# EAGLE design untitled (EAGLE 7.2.0)
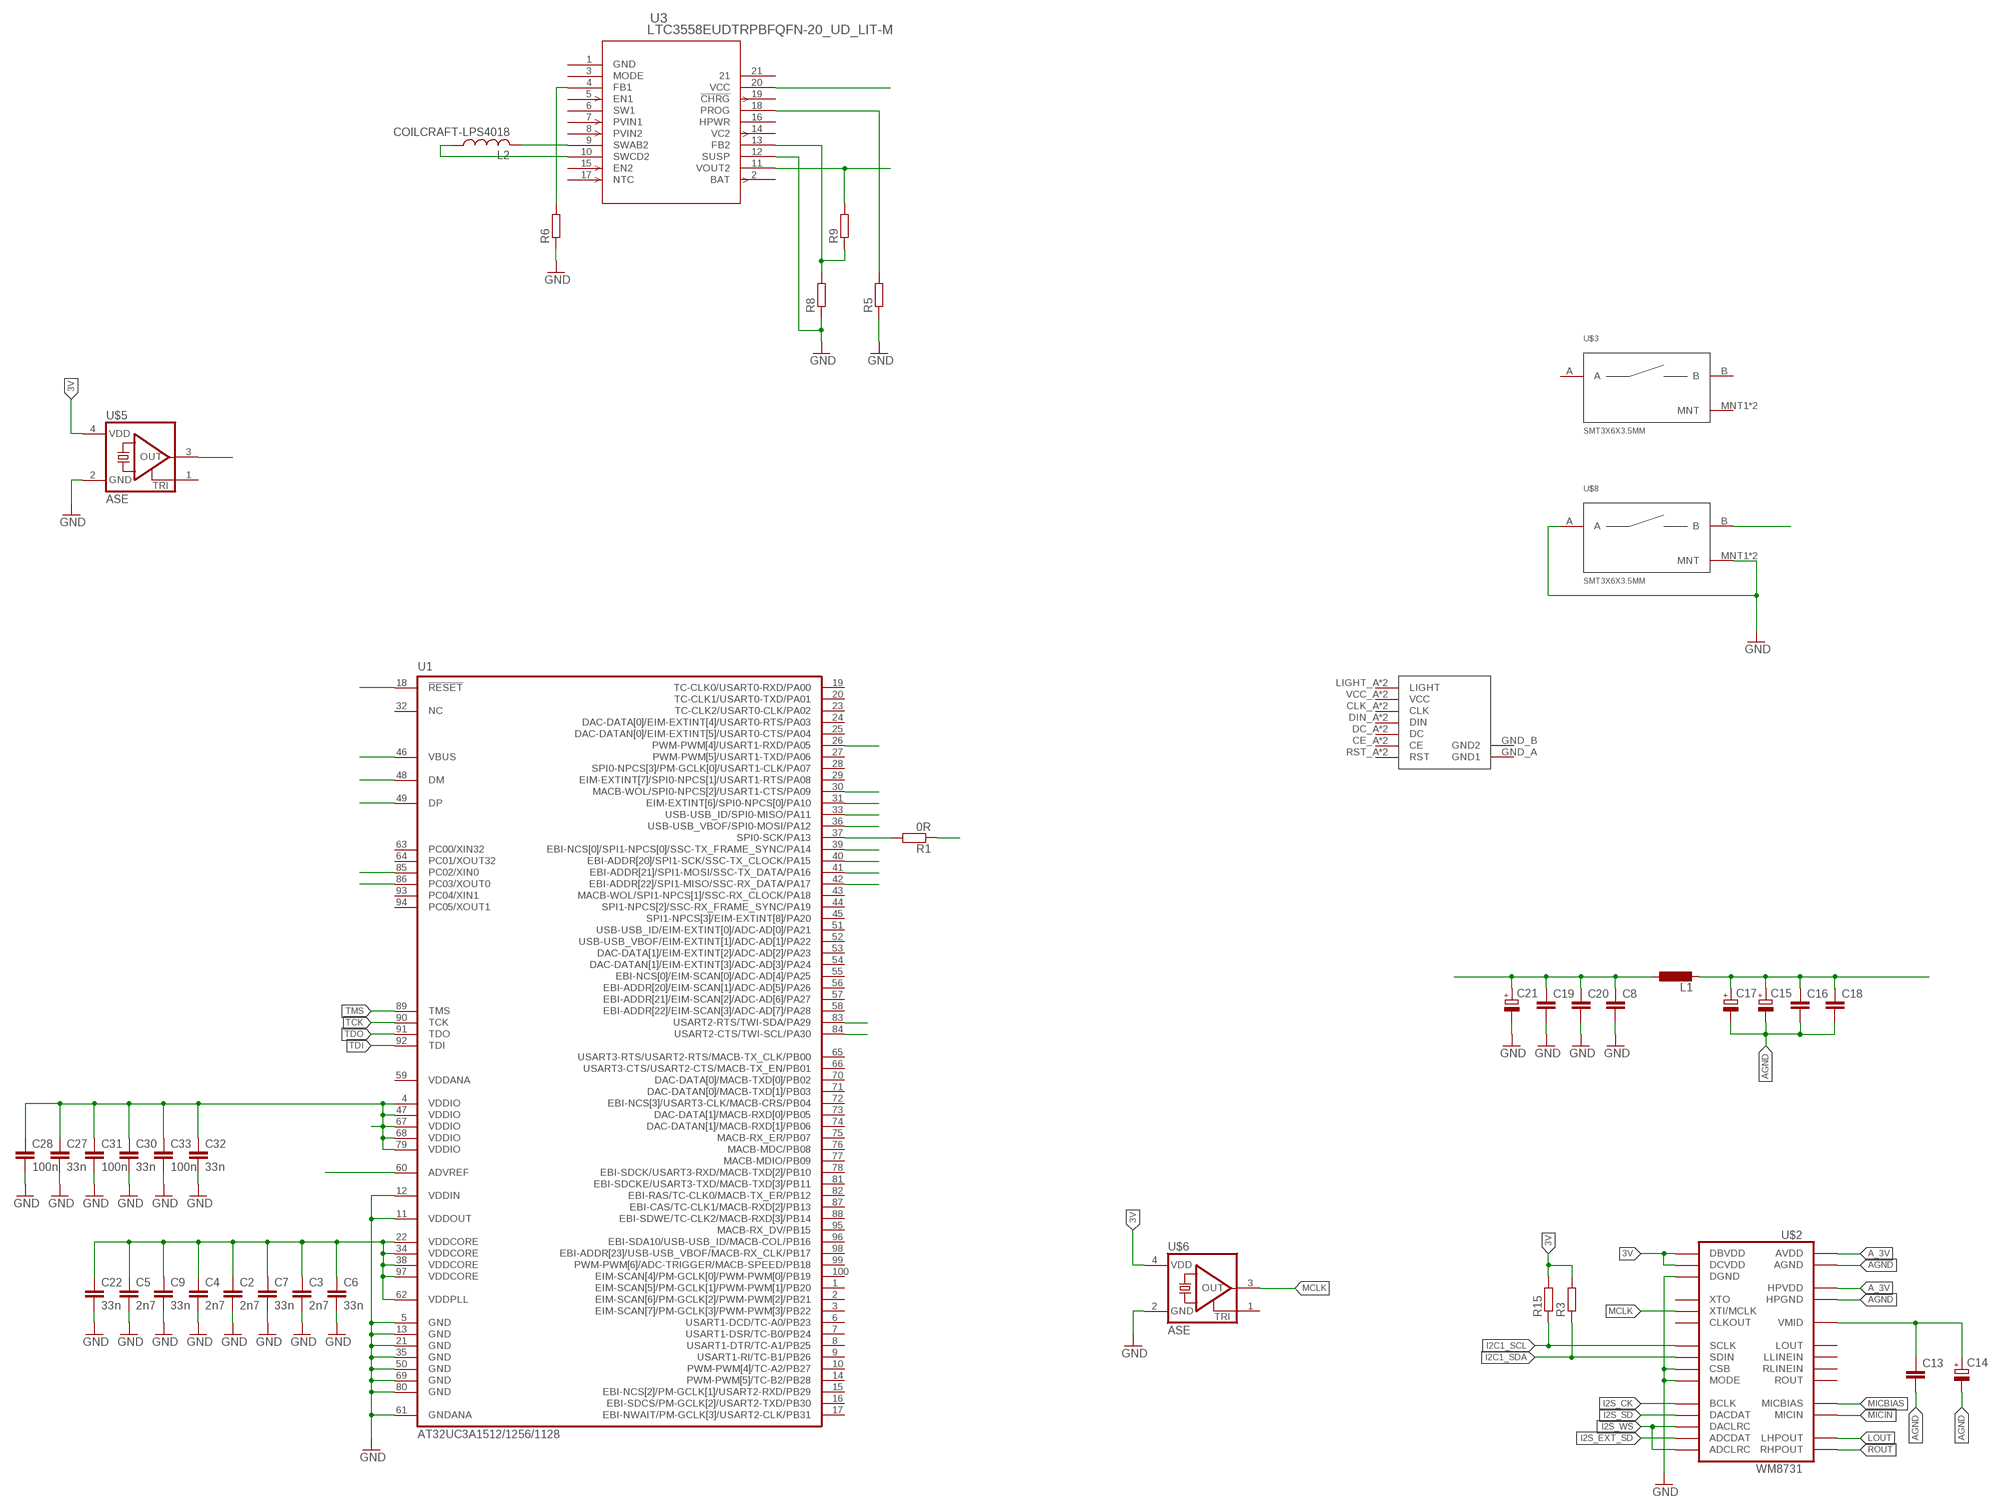
[diagram p0: schematic, sheet 1, part 1 of 2]
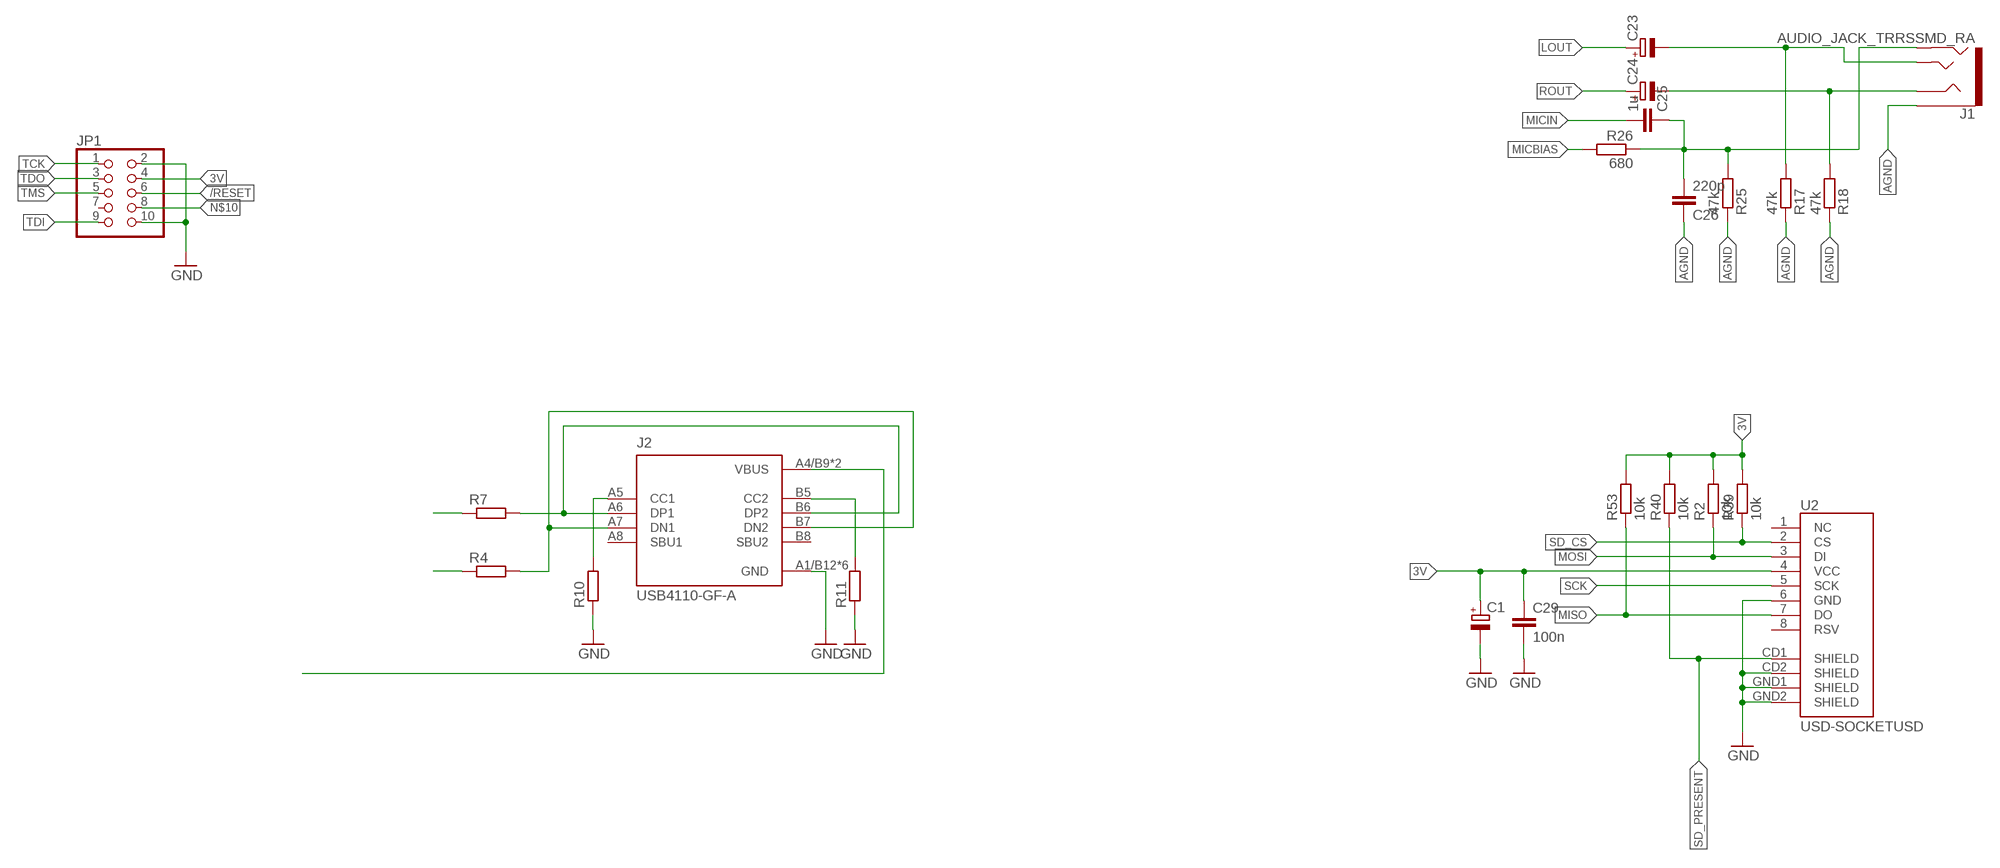
[diagram p1: schematic, sheet 1, part 2 of 2]

## Parts
C1  CPOL-EUSMCA  [SMC_A]
C2  2n7  C-EUC0402  [C0402]
C3  2n7  C-EUC0402  [C0402]
C4  2n7  C-EUC0402  [C0402]
C5  2n7  C-EUC0402  [C0402]
C6  33n  C-EUC0402  [C0402]
C7  33n  C-EUC0402  [C0402]
C8  C-EUC0402  [C0402]
C9  33n  C-EUC0402  [C0402]
C13  C-EUC0603  [C0603]
C14  CPOL-EUSMCA  [SMC_A]
C15  CPOL-EUSMCA  [SMC_A]
C16  C-EUC0603  [C0603]
C17  CPOL-EUSMCA  [SMC_A]
C18  C-EUC0603  [C0603]
C19  C-EUC0603  [C0603]
C20  C-EUC0402  [C0402]
C21  CPOL-EUSMCA  [SMC_A]
C22  33n  C-EUC0402  [C0402]
C23  CPOL-EUSMCE  [SMC_E]
C24  CPOL-EUSMCE  [SMC_E]
C25  1u  C-EUC0603  [C0603]
C26  220p  C-EUC0603  [C0603]
C27  33n  C-EUC0402  [C0402]
C28  100n  C-EUC0402  [C0402]
C29  100n  C-EUC0603  [C0603]
C30  33n  C-EUC0402  [C0402]
C31  100n  C-EUC0402  [C0402]
C32  33n  C-EUC0402  [C0402]
C33  100n  C-EUC0402  [C0402]
J1  AUDIO_JACK_TRRSSMD_RA  [AUDIO_JACK_3.5MM_TRRS_SMD_RA]
J2  USB4110-GF-A  [GCT_USB4110-GF-A]
JP1  PINHD-2X5  [2X05]
L1  L-EUL3225M  [L3225M]
L2  COILCRAFT-LPS4018  [LPS4018]
R1  0R  R-EU_R0603  [R0603]
R2  10k  R-EU_R0402  [R0402]
R3  R-EU_R0402  [R0402]
R4  R-EU_R0402  [R0402]
R5  R-EU_R0402  [R0402]
R6  R-EU_R0402  [R0402]
R7  R-EU_R0402  [R0402]
R8  R-EU_R0402  [R0402]
R9  R-EU_R0402  [R0402]
R10  R-EU_R0402  [R0402]
R11  R-EU_R0402  [R0402]
R15  R-EU_R0402  [R0402]
R17  47k  R-EU_R0603  [R0603]
R18  47k  R-EU_R0603  [R0603]
R25  47k  R-EU_R0603  [R0603]
R26  680  R-EU_R0603  [R0603]
R39  10k  R-EU_R0603  [R0603]
R40  10k  R-EU_R0603  [R0603]
R53  10k  R-EU_R0603  [R0603]
U1  AT32UC3A1512/1256/1128  [TQFP100]
U2  USD-SOCKETUSD  [USD-SOCKET-PP]
U3  LTC3558EUDTRPBFQFN-20_UD_LIT-M  [QFN-20_UD_LIT-M]
U$1  NOKIA5110_LCD  [NOKIA5110_LCD]
U$2  WM8731  [28-SSOP]
U$3  SMT3X6X3.5MM  [SMT3X6X3.5MM]
U$5  ASE  [ASE]
U$6  ASE  [ASE]
U$8  SMT3X6X3.5MM  [SMT3X6X3.5MM]

## Nets
3V: C1.+ C8.1 C19.1 C20.1 C21.+ C27.1 C28.1 C29.1 C30.1 C31.1 C32.1 C33.1 JP1.4 L1.1 R2.2 R3.2 R9.2 R15.2 R39.2 R40.2 R53.2 U1.4(VDDIO) U1.47(VDDIO) U1.60(ADVREF) U1.67(VDDIO) U1.68(VDDIO) U1.79(VDDIO) U2.4(VCC) U3.11(VOUT2) U$2.P$1(DBVDD) U$2.P$27(DCVDD) U$5.4(VDD) U$6.4(VDD)
/RESET: JP1.6 U1.18(!RESET)
A_3V: C15.+ C16.1 C17.+ C18.1 L1.2 U$2.P$8(HPVDD) U$2.P$14(AVDD)
AGND: C13.2 C14.- C15.- C16.2 C17.- C18.2 C26.1 J1.EARTH R17.1 R18.1 R25.1 U$2.P$11(HPGND) U$2.P$15(AGND)
D2_N: J2.A7(DN1) J2.B7(DN2) R4.2
D2_P: J2.A6(DP1) J2.B6(DP2) R7.2
D_N: R4.1 U1.48(DM)
D_P: R7.1 U1.49(DP)
GND: C1.- C2.2 C3.2 C4.2 C5.2 C6.2 C7.2 C8.2 C9.2 C19.2 C20.2 C21.- C22.2 C27.2 C28.2 C29.2 C30.2 C31.2 C32.2 C33.2 J2.A1/B12(GND) J2.B1/A12(GND) J2.S1(GND) J2.S2(GND) J2.S3(GND) J2.S4(GND) JP1.2 JP1.10 R5.1 R6.1 R8.1 R10.1 R11.1 U1.5(GND) U1.11(VDDOUT) U1.12(VDDIN) U1.13(GND) U1.21(GND) U1.35(GND) U1.50(GND) U1.61(GNDANA) U1.69(GND) U1.80(GND) U2.6(GND) U2.CD2(SHIELD) U2.GND1(SHIELD) U2.GND2(SHIELD) U3.12(SUSP) U$2.P$21(MODE) U$2.P$22(CSB) U$2.P$28(DGND) U$5.2(GND) U$6.2(GND) U$8.A U$8.MNT1(MNT) U$8.MNT2(MNT)
I2C1_SCL: R15.1 U1.84(USART2-CTS/TWI-SCL/PA30) U$2.P$24(SCLK)
I2C1_SDA: R3.1 U1.83(USART2-RTS/TWI-SDA/PA29) U$2.P$23(SDIN)
I2S_CK: U1.40(EBI-ADDR[20]/SPI1-SCK/SSC-TX_CLOCK/PA15) U$2.P$3(BCLK)
I2S_EXT_SD: U1.42(EBI-ADDR[22]/SPI1-MISO/SSC-RX_DATA/PA17) U$2.P$6(ADCDAT)
I2S_SD: U1.41(EBI-ADDR[21]/SPI1-MOSI/SSC-TX_DATA/PA16) U$2.P$4(DACDAT)
I2S_WS: U1.39(EBI-NCS[0]/SPI1-NPCS[0]/SSC-TX_FRAME_SYNC/PA14) U$2.P$5(DACLRC) U$2.P$7(ADCLRC)
KEY_VOLUP: U1.26(PWM-PWM[4]/USART1-RXD/PA05) U$8.B
LOUT: C23.+ U$2.P$9(LHPOUT)
MCLK: U$2.P$25(XTI/MCLK) U$6.3(OUT)
MICBIAS: R26.2 U$2.P$17(MICBIAS)
MICIN: C25.2 U$2.P$18(MICIN)
MISO: R53.1 U1.33(USB-USB_ID/SPI0-MISO/PA11) U2.7(DO)
MOSI: R2.1 U1.36(USB-USB_VBOF/SPI0-MOSI/PA12) U2.3(DI)
N$1: R1.2 U1.37(SPI0-SCK/PA13)
N$2: L2.2 U3.9(SWAB2)
N$3: L2.1 U3.10(SWCD2)
N$5: R5.2 U3.18(PROG)
N$6: R6.2 U3.4(FB1)
N$7: R8.2 R9.1 U3.13(FB2)
N$8: J2.B5(CC2) R11.2
N$9: J2.A5(CC1) R10.2
N$10: JP1.8
N$12: C13.1 C14.+ U$2.P$16(VMID)
N$13: C23.- J1.TIP R17.2
N$15: C24.- J1.RING1 R18.2
N$55: C25.1 C26.2 J1.RING2 R25.2 R26.1
OSC_IN: U1.85(PC02/XIN0) U$5.3(OUT)
OSC_OUT: U1.86(PC03/XOUT0)
ROUT: C24.+ U$2.P$10(RHPOUT)
SCK: R1.1 U2.5(SCK)
SD_CS: R39.1 U1.31(EIM-EXTINT[6]/SPI0-NPCS[0]/PA10) U2.2(CS)
SD_PRESENT: R40.1 U1.30(MACB-WOL/SPI0-NPCS[2]/USART1-CTS/PA09) U2.CD1(SHIELD)
TCK: JP1.1 U1.90(TCK)
TDI: JP1.9 U1.92(TDI)
TDO: JP1.3 U1.91(TDO)
TMS: JP1.5 U1.89(TMS)
VBUS: J2.A4/B9(VBUS) J2.B4/A9(VBUS) U1.46(VBUS) U3.20(VCC)
VDDCORE: C2.1 C3.1 C4.1 C5.1 C6.1 C7.1 C9.1 C22.1 U1.22(VDDCORE) U1.34(VDDCORE) U1.38(VDDCORE) U1.62(VDDPLL) U1.97(VDDCORE)
Unconnected: J2.A8(SBU1) J2.B8(SBU2) JP1.7 U1.1(EIM-SCAN[5]/PM-GCLK[1]/PWM-PWM[1]/PB20) U1.2(EIM-SCAN[6]/PM-GCLK[2]/PWM-PWM[2]/PB21) U1.3(EIM-SCAN[7]/PM-GCLK[3]/PWM-PWM[3]/PB22) U1.6(USART1-DCD/TC-A0/PB23) U1.7(USART1-DSR/TC-B0/PB24) U1.8(USART1-DTR/TC-A1/PB25) U1.9(USART1-RI/TC-B1/PB26) U1.10(PWM-PWM[4]/TC-A2/PB27) U1.14(PWM-PWM[5]/TC-B2/PB28) U1.15(EBI-NCS[2]/PM-GCLK[1]/USART2-RXD/PB29) U1.16(EBI-SDCS/PM-GCLK[2]/USART2-TXD/PB30) U1.17(EBI-NWAIT/PM-GCLK[3]/USART2-CLK/PB31) U1.19(TC-CLK0/USART0-RXD/PA00) U1.20(TC-CLK1/USART0-TXD/PA01) U1.23(TC-CLK2/USART0-CLK/PA02) U1.24(DAC-DATA[0]/EIM-EXTINT[4]/USART0-RTS/PA03) U1.25(DAC-DATAN[0]/EIM-EXTINT[5]/USART0-CTS/PA04) U1.27(PWM-PWM[5]/USART1-TXD/PA06) U1.28(SPI0-NPCS[3]/PM-GCLK[0]/USART1-CLK/PA07) U1.29(EIM-EXTINT[7]/SPI0-NPCS[1]/USART1-RTS/PA08) U1.32(NC) U1.43(MACB-WOL/SPI1-NPCS[1]/SSC-RX_CLOCK/PA18) U1.44(SPI1-NPCS[2]/SSC-RX_FRAME_SYNC/PA19) U1.45(SPI1-NPCS[3]/EIM-EXTINT[8]/PA20) U1.51(USB-USB_ID/EIM-EXTINT[0]/ADC-AD[0]/PA21) U1.52(USB-USB_VBOF/EIM-EXTINT[1]/ADC-AD[1]/PA22) U1.53(DAC-DATA[1]/EIM-EXTINT[2]/ADC-AD[2]/PA23) U1.54(DAC-DATAN[1]/EIM-EXTINT[3]/ADC-AD[3]/PA24) U1.55(EBI-NCS[0]/EIM-SCAN[0]/ADC-AD[4]/PA25) U1.56(EBI-ADDR[20]/EIM-SCAN[1]/ADC-AD[5]/PA26) U1.57(EBI-ADDR[21]/EIM-SCAN[2]/ADC-AD[6]/PA27) U1.58(EBI-ADDR[22]/EIM-SCAN[3]/ADC-AD[7]/PA28) U1.63(PC00/XIN32) U1.64(PC01/XOUT32) U1.65(USART3-RTS/USART2-RTS/MACB-TX_CLK/PB00) U1.66(USART3-CTS/USART2-CTS/MACB-TX_EN/PB01) U1.70(DAC-DATA[0]/MACB-TXD[0]/PB02) U1.71(DAC-DATAN[0]/MACB-TXD[1]/PB03) U1.72(EBI-NCS[3]/USART3-CLK/MACB-CRS/PB04) U1.73(DAC-DATA[1]/MACB-RXD[0]/PB05) U1.74(DAC-DATAN[1]/MACB-RXD[1]/PB06) U1.75(MACB-RX_ER/PB07) U1.76(MACB-MDC/PB08) U1.77(MACB-MDIO/PB09) U1.78(EBI-SDCK/USART3-RXD/MACB-TXD[2]/PB10) U1.81(EBI-SDCKE/USART3-TXD/MACB-TXD[3]/PB11) U1.82(EBI-RAS/TC-CLK0/MACB-TX_ER/PB12) U1.87(EBI-CAS/TC-CLK1/MACB-RXD[2]/PB13) U1.88(EBI-SDWE/TC-CLK2/MACB-RXD[3]/PB14) U1.93(PC04/XIN1) U1.94(PC05/XOUT1) U1.95(MACB-RX_DV/PB15) U1.96(EBI-SDA10/USB-USB_ID/MACB-COL/PB16) U1.98(EBI-ADDR[23]/USB-USB_VBOF/MACB-RX_CLK/PB17) U1.99(PWM-PWM[6]/ADC-TRIGGER/MACB-SPEED/PB18) U1.100(EIM-SCAN[4]/PM-GCLK[0]/PWM-PWM[0]/PB19) U2.1(NC) U2.8(RSV) U3.2(BAT) U3.3(MODE) U3.5(EN1) U3.6(SW1) U3.7(PVIN1) U3.8(PVIN2) U3.14(VC2) U3.15(EN2) U3.16(HPWR) U3.17(NTC) U3.19(!CHRG) U3.21 U$1.CE_A(CE) U$1.CE_B(CE) U$1.CLK_A(CLK) U$1.CLK_B(CLK) U$1.DC_A(DC) U$1.DC_B(DC) U$1.DIN_A(DIN) U$1.DIN_B(DIN) U$1.GND_A(GND1) U$1.GND_B(GND2) U$1.LIGHT_A(LIGHT) U$1.LIGHT_B(LIGHT) U$1.RST_A(RST) U$1.RST_B(RST) U$1.VCC_A(VCC) U$1.VCC_B(VCC) U$2.P$2(CLKOUT) U$2.P$12(LOUT) U$2.P$13(ROUT) U$2.P$19(RLINEIN) U$2.P$20(LLINEIN) U$2.P$26(XTO) U$3.A U$3.B U$3.MNT1(MNT) U$3.MNT2(MNT) U$5.1(TRI) U$6.1(TRI)

## Power pins joined to a net without a drawn wire
GND: U3.1(GND)
VDDANA: U1.59(VDDANA)

## Library data of the parts
C1 C14 C15 C17 C21 C23 C24 = rcl:CPOL-EU: POLARIZED CAPACITOR, European symbol
C2-C9 C13 C16 C18-C20 C22 C25-C33 = rcl:C-EU: CAPACITOR, European symbol
J1 = SparkFun-Connectors:AUDIO_JACK_TRRS: Audio Jack - 3.5mm TRRS (SMD) This is a 3.5mm TRRS SMD audio jack. TRRS connectors are the audio-style connectors that you see on some phones, MP3 players and development boards. TRRS stands for “tip, ring, ring, sleeve,” which reflects that this has three conductors and a ground. SparkFun Products: Audio Jack <https://www.sparkfun.com/products/12639> mbed Starter Kit <https://www.sparkfun.com/products/12968> SparkFun TRRS 3.5mm Jack Breakout <https://www.sparkfun.com/products/11570>; PROD_ID: CONN-10676; SF_ID: PRT-12639
J2 = connector_tst:USB4110-GF-A: CONN USB 2.0 TYPE-C R/A SMT; DIGIKEY: 073-USB4110-GF-A-1-ND; MANUFACTURER: GCT; MPN: USB4110-GF-A
JP1 = pinhead:PINHD-2X5: PIN HEADER
L1 = rcl:L-EU: INDUCTOR, European symbol
L2 = passives:COILCRAFT-LPS4018: Coilcraft Shielded SMT Power Inductors – LPS4018 Series
R1-R11 R15 R17 R18 R25 R26 R39 R40 R53 = rcl:R-EU_: RESISTOR, European symbol
U1 = atmel-avr32:AT32UC3A1512/1256/1128: AT32UC3A1512/1256/1128
U2 = SparkFun-Connectors:USD-SOCKET: microSD Socket Push-push type uSD socket. Schematic element and footprint production proven. Spark Fun Electronics SKU : PRT-00127. tDoc lines correctly indicate media card edge positions when inserting (unlocked, locked, depressed).
U3 = mw:LTC3558EUDTRPBF; COPYRIGHT: Copyright (C) 2026 Ultra Librarian. All rights reserved.; DATASHEET: https://www.analog.com/media/en/technical-documentation/data-sheets/3558.pdf; DESCRIPTION: Linear USB Battery Charger with Buck and Buck-Boost Regulators; MANUFACTURER_NAME: Analog Devices Inc; MANUFACTURER_PART_NUMBER: LTC3558EUD#TRPBF
U$1 = common:NOKIA5110_LCD
U$2 = microdecv1:WM8731
U$3 U$8 = mw:SMT3X6X3.5MM
U$5 U$6 = crystal:ASE: 3.3Vdc CMOS SMD CRYSTAL CLOCK OSCILLATOR SOurce: www.abracon.com; OC_FARNELL: unknown; OC_NEWARK: unknown

## Board
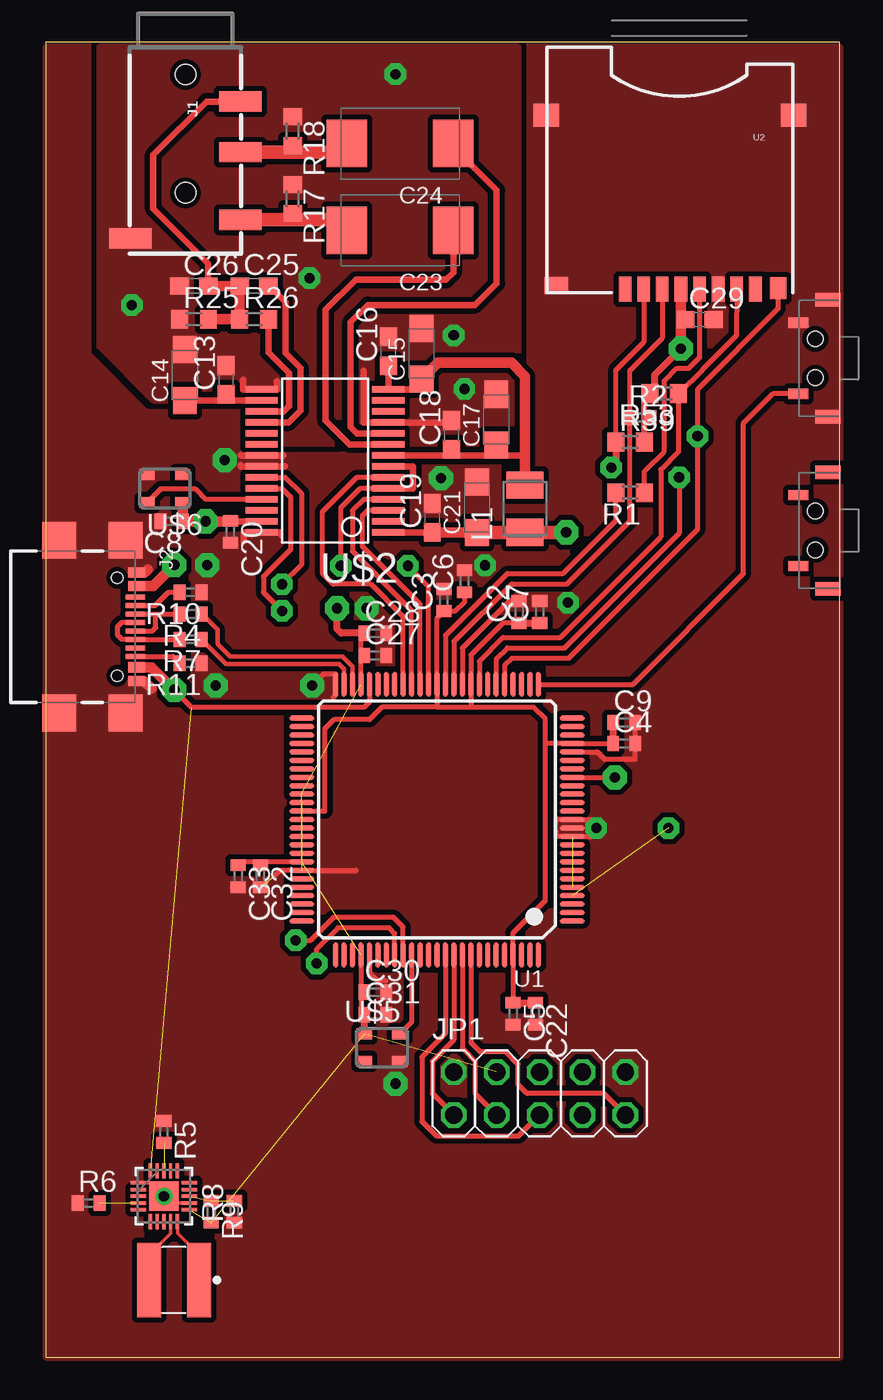
[diagram p2: board, top side]
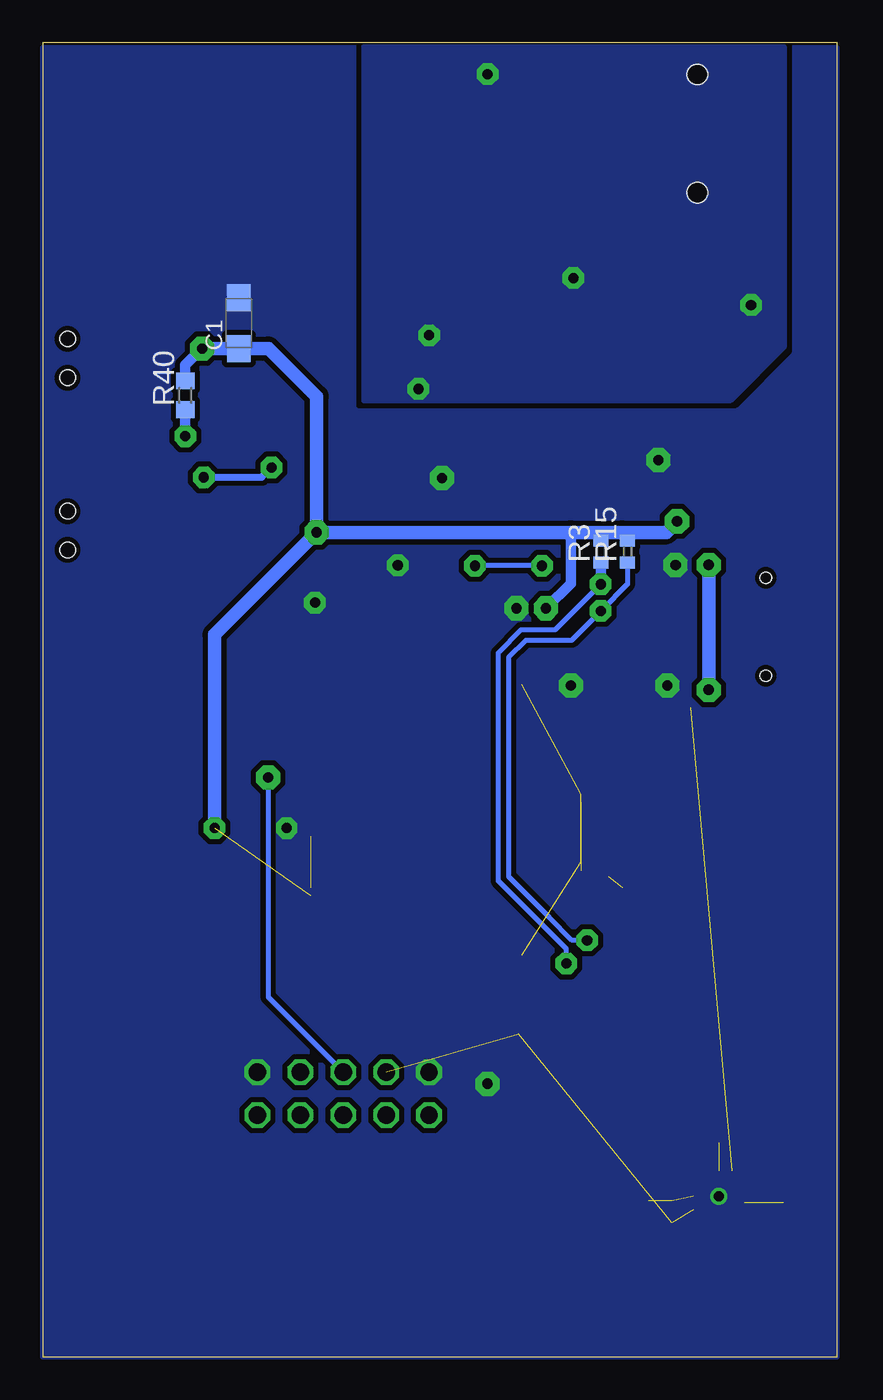
[diagram p3: board, bottom side, seen from below]

Size 46.97 x 77.78 mm. Coordinates in mm from the lower left corner, seen from the top.
Outline: 0,0 46.97,0 46.97,77.78 0,77.78 0,0
Copper layers (1*16): Top 0.035mm / dielectric 1.5mm / Bottom 0.035mm
Design rules "default *": minimum track width 10mil, minimum drill 24mil, track to track 8mil, track to pad 8mil, pad to pad 8mil, via to via 8mil, smd to smd 8mil, copper to edge 0mil, drill to drill 8mil, minimum pad ring 10mil, minimum via ring 8mil, stop-mask expansion 4mil, vias tented up to drill 0mil, thermal gap 10mil
tRestrict: area 19.6,40.3 to 20.7,40.6

### Footprints (pad centres in the part's own frame; a part is rotated, then mirrored left to right if it is on the bottom)
SMC_A = smd 1.6 x 1.4: + -1.5,0; - 1.5,0
C0402 = smd 0.7 x 0.9: 1 -0.65,0; 2 0.65,0
C0603 = smd 1.1 x 1: 1 -0.85,0; 2 0.85,0
SMC_E = smd 2.4 x 2.8: + -3.15,0; - 3.15,0
AUDIO_JACK_3.5MM_TRRS_SMD_RA = smd 1.2 x 2.5: EARTH 11.3,-3.25; RING1 6.2,3.25; RING2 3.2,3.25; TIP 10.2,3.25 | hole 1.2: 1.6,0; 8.6,0
GCT_USB4110-GF-A = smd 0.6 x 1: A1/B12 -3.2,1.15; A4/B9 -2.4,1.15; B1/A12 3.2,1.15; B4/A9 2.4,1.15 | smd 0.3 x 1.15: A5 -1.25,1.075; A6 -0.25,1.075; A7 0.25,1.075; A8 1.25,1.075; B5 1.75,1.075; B6 0.75,1.075; B7 -0.75,1.075; B8 -1.75,1.075 | smd 2.18 x 2: S1 -5.11,0.5; S2 5.11,0.5; S3 -5.11,-3.43; S4 5.11,-3.43 | hole 0.65: -2.89,0; 2.89,0
2X05 = drill 1.016 octagon: 1 -5.08,-1.27; 2 -5.08,1.27; 3 -2.54,-1.27; 4 -2.54,1.27; 5 0,-1.27; 6 0,1.27; 7 2.54,-1.27; 8 2.54,1.27; 9 5.08,-1.27; 10 5.08,1.27
L3225M = smd 1.6 x 2.2: 1 -1.4,0; 2 1.4,0
LPS4018 = smd 1.435 x 4.394: 1 -1.48,0; 2 1.48,0
R0603 = smd 1 x 1.1: 1 -0.85,0; 2 0.85,0
R0402 = smd 0.7 x 0.9: 1 -0.65,0; 2 0.65,0
TQFP100 = smd 1.5 x 0.3: 1 -8,6; 2 -8,5.5; 3 -8,5; 4 -8,4.5; 5 -8,4; 6 -8,3.5; 7 -8,3; 8 -8,2.5; 9 -8,2; 10 -8,1.5; 11 -8,1; 12 -8,0.5; 13 -8,0; 14 -8,-0.5; 15 -8,-1; 16 -8,-1.5; 17 -8,-2; 18 -8,-2.5; 19 -8,-3; 20 -8,-3.5; 21 -8,-4; 22 -8,-4.5; 23 -8,-5; 24 -8,-5.5; 25 -8,-6; 51 8,-6; 52 8,-5.5; 53 8,-5; 54 8,-4.5; 55 8,-4; 56 8,-3.5; 57 8,-3; 58 8,-2.5; 59 8,-2; 60 8,-1.5; 61 8,-1; 62 8,-0.5; 63 8,0; 64 8,0.5; 65 8,1; 66 8,1.5; 67 8,2; 68 8,2.5; 69 8,3; 70 8,3.5; 71 8,4; 72 8,4.5; 73 8,5; 74 8,5.5; 75 8,6 | smd 0.3 x 1.5: 26 -6,-8; 27 -5.5,-8; 28 -5,-8; 29 -4.5,-8; 30 -4,-8; 31 -3.5,-8; 32 -3,-8; 33 -2.5,-8; 34 -2,-8; 35 -1.5,-8; 36 -1,-8; 37 -0.5,-8; 38 0,-8; 39 0.5,-8; 40 1,-8; 41 1.5,-8; 42 2,-8; 43 2.5,-8; 44 3,-8; 45 3.5,-8; 46 4,-8; 47 4.5,-8; 48 5,-8; 49 5.5,-8; 50 6,-8; 76 6,8; 77 5.5,8; 78 5,8; 79 4.5,8; 80 4,8; 81 3.5,8; 82 3,8; 83 2.5,8; 84 2,8; 85 1.5,8; 86 1,8; 87 0.5,8; 88 0,8; 89 -0.5,8; 90 -1,8; 91 -1.5,8; 92 -2,8; 93 -2.5,8; 94 -3,8; 95 -3.5,8; 96 -4,8; 97 -4.5,8; 98 -5,8; 99 -5.5,8; 100 -6,8
USD-SOCKET-PP = smd 0.75 x 1.5: 1 3.2,14.3; 2 2.1,14.3; 3 1,14.3; 4 -0.1,14.3; 5 -1.2,14.3; 6 -2.3,14.3; 7 -3.4,14.3; 8 -4.5,14.3 | smd 1 x 1.3: CD1 -5.85,14.25 | smd 1.4 x 1: CD2 7.275,14.1 | smd 1.5 x 1.35: GND1 -6.775,4; GND2 7.875,4
QFN-20_UD_LIT-M = smd 0.906 x 0.199: 1 -1.503,0.8; 2 -1.503,0.4; 3 -1.503,0; 4 -1.503,-0.4; 5 -1.503,-0.8; 11 1.503,-0.8; 12 1.503,-0.4; 13 1.503,0; 14 1.503,0.4; 15 1.503,0.8 | smd 0.199 x 0.906: 6 -0.8,-1.503; 7 -0.4,-1.503; 8 0,-1.503; 9 0.4,-1.503; 10 0.8,-1.503; 16 0.8,1.503; 17 0.4,1.503; 18 0,1.503; 19 -0.4,1.503; 20 -0.8,1.503 | smd 1.75 x 1.75: 21 0,0
NOKIA5110_LCD = drill 1.016 pad 1.778 octagon: CE_A -6.35,0; CE_B -6.35,38.5; CLK_A 1.27,0; CLK_B 1.27,38.5; DC_A -3.81,0; DC_B -3.81,38.5; DIN_A -1.27,0; DIN_B -1.27,38.5; GND_A 8.89,0; GND_B 8.89,38.5; LIGHT_A 6.35,0; LIGHT_B 6.35,38.5; RST_A -8.89,0; RST_B -8.89,38.5; VCC_A 3.81,0; VCC_B 3.81,38.5
28-SSOP = smd 0.381 x 1.905: P$1 -4.55,-3.752; P$2 -3.9,-3.752; P$3 -3.25,-3.752; P$4 -2.6,-3.752; P$5 -1.95,-3.752; P$6 -1.3,-3.752; P$7 -0.65,-3.752; P$8 0,-3.752; P$9 0.65,-3.752; P$10 1.3,-3.752; P$11 1.95,-3.752; P$12 2.6,-3.752; P$13 3.25,-3.752; P$14 3.9,-3.752; P$15 3.9,3.752; P$16 3.25,3.752; P$17 2.6,3.752; P$18 1.95,3.752; P$19 1.3,3.752; P$20 0.65,3.752; P$21 0,3.752; P$22 -0.65,3.752; P$23 -1.3,3.752; P$24 -1.95,3.752; P$25 -2.6,3.752; P$26 -3.25,3.752; P$27 -3.9,3.752; P$28 -4.55,3.752
SMT3X6X3.5MM = smd 0.6 x 1.2: A -2.1,-1; B 2.1,-1 | smd 0.8 x 1.5: MNT1 -3.45,0.75; MNT2 3.45,0.75 | hole 0.9: 1.15,0; -1.15,0
ASE = smd 0.9 x 0.65: 1 -1.05,-0.825; 2 1.05,-0.825; 3 1.05,0.825; 4 -1.05,0.825

### Placement (x,y rotation side)
C1  35.38,61.16 90 bottom
C2  27.99,44.07 90 top
C3  23.55,44.78 90 top
C4  34.21,36.3 0 top
C5  27.64,20.32 270 top
C6  24.77,45.9 90 top
C7  29.21,44.07 90 top
C8  7.44,49.44 180 top
C9  34.21,37.54 0 top
C13  10.67,57.8 90 top
C14  8.23,58.09 90 top
C15  22.23,59.35 90 top
C16  20.26,59.49 90 top
C17  26.64,55.45 90 top
C18  24,54.55 90 top
C19  22.86,49.64 90 top
C20  10.92,48.82 270 top
C21  25.5,50.27 90 top
C22  28.96,20.32 270 top
C23  20.95,66.65 180 top
C24  20.95,71.78 180 top
C25  12.32,63.35 0 top
C26  8.76,63.35 0 top
C27  19.49,41.5 0 top
C28  19.49,42.82 0 top
C29  38.66,61.37 0 top
C30  19.49,21.59 0 top
C31  19.49,20.27 0 top
C32  12.7,28.45 270 top
C33  11.38,28.45 270 top
J1  8.26,77.47 270 top
J2  4.22,43.21 270 top
JP1  29.21,15.6 0 top
L1  28.35,50.19 90 top
L2  7.58,4.57 180 top
R1  34.56,51.13 180 top
R2  35.1,55.58 0 top
R3  13.97,47.65 90 bottom
R4  8.56,43.96 180 top
R5  6.99,13.34 270 top
R6  2.54,9.12 0 top
R7  8.56,42.46 180 top
R8  11.15,8.61 90 top
R9  9.78,8.61 270 top
R10  8.56,45.24 180 top
R11  8.56,41.05 180 top
R15  12.4,47.65 90 bottom
R17  14.61,68.5 270 top
R18  14.61,72.52 270 top
R25  8.76,61.39 0 top
R26  12.32,61.39 0 top
R39  34.56,54.13 0 top
R40  38.56,56.9 90 bottom
R53  36.58,57 180 top
U1  23.14,31.8 180 top
U2  37.47,77.47 180 top
U3  6.99,9.53 0 top
U$1  -29.21,27.3 0 top  (outside the outline)
U$2  16.51,53.34 90 top
U$3  45.52,48.9 270 top
U$5  19.89,18.31 0 top
U$6  7.04,51.38 180 top
U$8  45.52,59.08 270 top

### Tracks (layer width: path | path; a pad name or v marks a point on that pad's centre or on a via)
3V  (via drill 0.6 pad 1.27, 0.6 pad 1.42)  (8 unrouted)
  Top 0.305: R2.2 35.72,55.58 35.41,55.88 | U1.79 18.64,21.59 | 18.64,21.59 18.64,20.47 C31.1 | C30.1 18.64,21.59 | U1.68 12.7,29.3 | 12.7,29.3 11.58,29.3 C33.1 | C32.1 12.7,29.3 | U1.47 18.64,41.04 18.64,41.27 | 18.64,41.27 18.64,41.68 18.64,42.63 C28.1 | C27.1 18.84,41.47 18.64,41.27
  Top 0.368: R39.2 35.41,55.88 35.41,56.68 R53.2
  Top 0.381: U$2.P$1 C19.1 | 25.48,48.79 C21.+ | 28.32,48.77 L1.1 | U$2.P$27 10.79,49.44 10.82,49.47 C20.1
  Top 0.406: R53.2 36.02,57 | U$5.4 C31.1 | C28.1 17.48,42.82 17.22,43.08 v17.22,44.3
  Top 0.417: 36.02,57 36.02,58.11 v37.57,59.66
  Top 0.61: C19.1 25.48,48.79 | v37.57,59.66 37.57,61.59 | 37.57,61.59 U2.4 | C29.1 37.8,61.37 37.57,61.59 | U$6.4 C8.1 v9.46,49.44 10.79,49.44
  Top 0.813: C21.+ 28.32,48.77 | L1.1 v30.79,48.79
  Bottom 0.61: C1.+ 35.56,59.66 | v37.56,59.66 v37.57,59.66 38.56,58.67 R40.2 | v17.22,44.3 15.75,45.77 15.75,48.79 | R3.2 13.97,48.79 | R15.2 12.39,48.49 12.7,48.79
  Bottom 0.813: v30.79,48.79 15.75,48.79 13.97,48.79 12.7,48.79 10.11,48.79 v9.46,49.44 | 35.56,59.66 v37.57,59.66 | v36.83,31.3 36.83,42.74 v30.79,48.79 | v30.79,48.79 30.79,56.82 33.63,59.66 C1.+
/RESET  (via drill 0.6 pad 1.42)
  Top 0.305: U1.18 v33.66,34.3
  Bottom 0.305: v33.66,34.3 33.66,21.31 JP1.6
A_3V
  Top 0.381: U$2.P$8 24,53.34 | 24,53.34 26.54,53.34 | C16.1 U$2.P$14 21.61,57.24 C15.+ | 26.54,53.34 C17.+ | C18.1 24,53.34 | 26.54,53.34 28.35,53.34
  Top 0.61: L1.2 28.35,53.34 28.35,58.01 27.54,58.83 23.2,58.83 C15.+
AGND  (via drill 0.6 pad 1.27)
  Top 0.381: 11.66,57.84 11.66,57.24 U$2.P$15 13.69,57.24 13.69,57.73 | C18.2 23.89,55.29 U$2.P$11 18.8,55.29 18.8,58.34
  other vias: 5.08,62.23 24.77,57.28 24.13,60.45 15.6,63.83 20.68,75.9
  pour Top (isolate 0.305, no thermals): 3.17,77.47 3.17,59.79 6.35,56.62 12.06,56.62 12.06,54.08 27.94,54.08 27.94,77.47
  pour Bottom: 3.12,77.52 3.12,59.77 6.32,56.57 27.99,56.57 27.99,77.52
D2_N
  Top 0.305: J2.B7 6.58,43.95 | 6.58,43.95 R4.2 | J2.A7 6.3,42.95 6.5,43.16 6.5,43.91 6.58,43.95
D2_P
  Top 0.305: R7.2 J2.B6 4.51,42.45 4.24,42.72 4.24,43.2 4.49,43.45 J2.A6
D_N
  Top 0.254: U1.48 18.14,40.86 17.54,41.45 10.89,41.45 10.16,42.18 10.16,43.05 9.26,43.95 R4.1
D_P
  Top 0.254: U1.49 17.64,40.71 17.36,41 10.67,41 R7.1
GND  (via drill 0.6, 0.6 pad 1.27, 0.6 pad 1.42)  (3 unrouted)
  Top 0.203: U3.1 6.18,10.32 v6.99,9.53 7.38,9.12 U3.12
  Top 0.305: 13.84,48.79 13.89,48.79 13.89,48.59 | U1.21 32.63,35.8 33.05,35.38 34.86,35.38 C4.2 C9.2 | C2.2 27.42,44.72 24.64,41.94 U1.35 | 17.02,39.04 17.14,39.16 U1.50 17.14,40.39 17.12,40.41 16.43,40.41 v15.75,39.73 | U1.80 19.14,22.75 19.61,22.28 20.09,22.28 20.12,22.25 | 13.51,28.42 13.89,28.8 U1.69 18.34,28.8 18.36,28.78 | 30.18,31.09 30.18,30.8 U1.11 32.56,30.8 v32.56,31.3 32.56,31.8 U1.13 30.18,31.8 30.18,31.67
  Top 0.381: 11.51,53.37 11.51,53.34 U$2.P$21 14.02,53.34 14.02,53.37 | 14.12,52.7 14.12,52.69 U$2.P$22 11.51,52.69 11.51,52.78 | U$2.P$28 13.84,48.79 | U$2.P$28 12.44,48.79 | U$2.P$28 11.76,48.79 11.71,48.74 11.71,48.28
  Top 0.61: J2.A1/B12 5.84,46.41 6.02,46.58 | J2.B1/A12 5.79,40.01 6.25,39.55
  other vias: 23.37,51.99 9.55,46.86 10.57,53.06 25.98,46.84 30.89,44.63 20.68,16.18 18.97,44.3 10.03,39.73
  pour Top (isolate 0.305, rank 2, no thermals): 0,77.47 0,0 46.99,0 46.99,77.47
  pour Bottom (isolate 0.305, rank 2, no thermals): 0,77.47 0,0 46.99,0 46.99,77.47
I2C1_SCL  (via drill 0.6 pad 1.27)
  Top 0.305: U$2.P$24 13.96,51.39 14.5,50.85 14.5,47.8 12.88,46.18 12.88,45.24 v13.97,44.15 | U1.84 21.14,25.44 20.57,26.01 17.02,26.01 15.67,24.66 v14.78,24.66
  Bottom 0.305: R15.1 12.39,45.72 v13.97,44.15 15.7,42.42 18.41,42.42 19.43,41.4 19.43,28.42 17.07,26.06 17.02,26.01 15.67,24.66 v14.78,24.66
I2C1_SDA  (via drill 0.6 pad 1.27)
  Top 0.305: U$2.P$23 14.18,52.04 15.11,51.1 15.11,46.86 v13.97,45.72 | U1.83 20.64,25.08 20.32,25.4 17.27,25.4 16.02,24.14 v16.02,23.29
  Bottom 0.305: v13.97,45.72 16.66,43.03 18.67,43.03 20.04,41.66 20.04,28.17 16.02,24.14 v16.02,23.29
  Bottom 0.61: R3.1 v13.97,45.72
I2S_CK
  Top 0.305: U$2.P$3 19.03,50.09 18.72,49.78 18.72,47.95 22.14,44.54 U1.40
I2S_EXT_SD
  Top 0.305: U1.42 21.14,43.81 19.23,45.72 16.99,45.72 16.36,46.35 16.36,50.01 18.39,52.04 U$2.P$6
I2S_SD
  Top 0.305: U$2.P$4 18.81,50.74 18.14,50.06 18.14,47.68 21.64,44.17 U1.41
I2S_WS  (via drill 0.6 pad 1.27)
  Top 0.305: U1.39 22.64,45.59 v21.42,46.81 | v17.45,46.81 17.45,50.24 18.6,51.39 U$2.P$5
  Top 0.381: U$2.P$5 21.72,51.39 21.72,52.69 U$2.P$7
  Bottom 0.305: v17.45,46.81 v21.42,46.81
KEY_VOLUP
  Top 0.305: U1.26 34.72,39.8 41.27,46.35 41.27,55.24 43.01,56.98 U$8.B
LOUT
  Top 0.381: U$2.P$9 17.97,53.99 16.56,55.4 16.56,61.95 18.34,63.73 23.67,63.73 24.11,64.16 C23.+
MCLK
  Top 0.305: U$6.3 6.81,51.38 8.82,51.38 9.46,50.74 U$2.P$25
MICBIAS
  Top 0.381: U$2.P$17 14.05,55.94 14.38,56.26 14.38,58.22 13.17,59.42 R26.2
MICIN
  Top 0.381: U$2.P$18 14.37,55.29 15.06,55.98 15.06,58.5 14.17,59.38 14.17,62.41 13.23,63.35 C25.2 13.21,63.35
MISO
  Top 0.305: U2.7 40.84,60.42 38.85,58.44 38.85,58.43 R53.1 37.43,53.55 36.37,52.5 36.37,48.51 30.43,42.57 27.05,42.57 25.64,41.16 U1.33
MOSI
  Top 0.305: 34.56,55.88 34.56,49.47 30.84,45.74 27.56,45.74 24.14,42.33 U1.36 | 34.56,55.88 34.56,58.36 36.47,60.27 U2.3 | R2.1 34.45,55.77 34.56,55.88
N$1
  Top 0.305: R1.2 33.71,49.48 30.58,46.35 27.3,46.35 23.64,42.69 U1.37
N$2
  Top 0.203: U3.9 7.38,7.33 6.11,6.05 L2.2
N$3
  Top 0.203: U3.10 7.79,7.33 9.06,6.05 L2.1
N$5  (1 unrouted)
N$6  (1 unrouted)
N$7  (2 unrouted)
N$8
  Top 0.305: J2.B5 7.5,41.45 R11.2
N$9
  Top 0.305: J2.A5 6.46,44.45 7.24,45.24 R10.2
N$12
  Top 0.381: U$2.P$16 10.79,56.59 | 10.79,56.59 C14.+ | C13.1 10.79,56.95 10.79,56.59 | C14.+
N$13
  Top 0.381: R17.2 14.61,67.27
  Top 0.813: J1.TIP 14.61,67.27 17.8,67.27 C23.-
N$15
  Top 0.381: R18.2 14.61,71.27
  Top 0.813: J1.RING1 14.61,71.27 17.8,71.27 C24.-
N$55
  Top 0.381: C26.2 9.61,64.68 6.35,67.94 6.35,71.12 9.5,74.27 J1.RING2
  Top 0.61: C25.1 11.51,63.38 | C25.1 R26.1 R25.2 | C25.1 C26.2
OSC_IN
  Top 0.305: U1.85 21.64,19.84 U$5.3
ROUT
  Top 0.381: U$2.P$10 18.41,54.64 18.03,55.02 18.03,61.21 19.05,62.23 25.4,62.23 26.67,63.5 26.67,69.01 24.11,71.58 C24.+
SCK
  Top 0.305: U2.5 38.66,59.11 38.05,58.5 37.34,58.5 36.58,57.73 36.58,53.57 35.41,52.4 R1.1
SD_CS  (via drill 0.6 pad 1.27)
  Top 0.305: R39.1 33.71,58.37 35.37,60.03 U2.2 | v37.47,52.05 37.47,48.74 30.68,41.96 27.3,41.96 26.64,41.3 U1.31
  Top 0.406: R39.1 33.71,52.89 v33.45,52.63
  Bottom 0.406: v37.47,52.05 34.04,52.05 v33.45,52.63
SD_PRESENT  (via drill 0.6 pad 1.27)
  Top 0.305: U2.CD1 43.31,62.01 38.56,57.25 v38.56,54.48 38.56,48.97 30.94,41.35 27.56,41.35 27.14,40.93 U1.30
  Bottom 0.61: v38.56,54.48 R40.1
TCK
  Top 0.305: U1.90 24.14,18.78 22.86,17.5 22.86,15.6 JP1.1
TDI
  Top 0.305: U1.92 25.14,18.62 25.68,18.09 27.18,18.09 27.94,17.32 27.94,16.13 28.47,15.6 33.02,15.6 JP1.9
TDO
  Top 0.305: U1.91 24.64,18.26 25.4,17.5 25.4,15.6 JP1.3
TMS
  Top 0.305: U1.89 23.64,19.14 22.25,17.75 22.25,13.95 23.11,13.08 27.96,13.08 JP1.5
VBUS  (via drill 0.61 pad 1.42)  (1 unrouted)
  Top 0.305: U1.46 19.14,38.75 18.82,38.43 8.64,38.43 v7.59,39.47
  Top 0.61: J2.A4/B9 6.34,45.6 v7.59,46.86 | J2.B4/A9 6.26,40.8 v7.59,39.47
  Bottom 0.813: v7.59,46.86 v7.59,39.47
VDDCORE
  Top 0.305: 23.14,38.46 U1.38 23.14,43.72 C3.1 24.22,44.13 24.77,44.68 C6.1 | 23.14,38.46 25.14,38.46 | 25.14,38.46 U1.34 25.14,41.52 27.04,43.42 C2.1 | 29.54,36.3 U1.22 C4.1 | 29.54,36.3 29.54,27 27.64,25.1 U1.97 C5.1 | 25.14,38.46 28.85,38.46 29.54,37.77 29.54,36.3 | U1.62 16.51,32.3 16.51,37.19 17.04,37.72 19.15,37.72 19.89,38.46 23.14,38.46
  Top 0.406: C2.1 C7.1 | C4.1 C9.1 | C5.1 C22.1